# Altium schematic sheet VGA.SchDoc
size A4
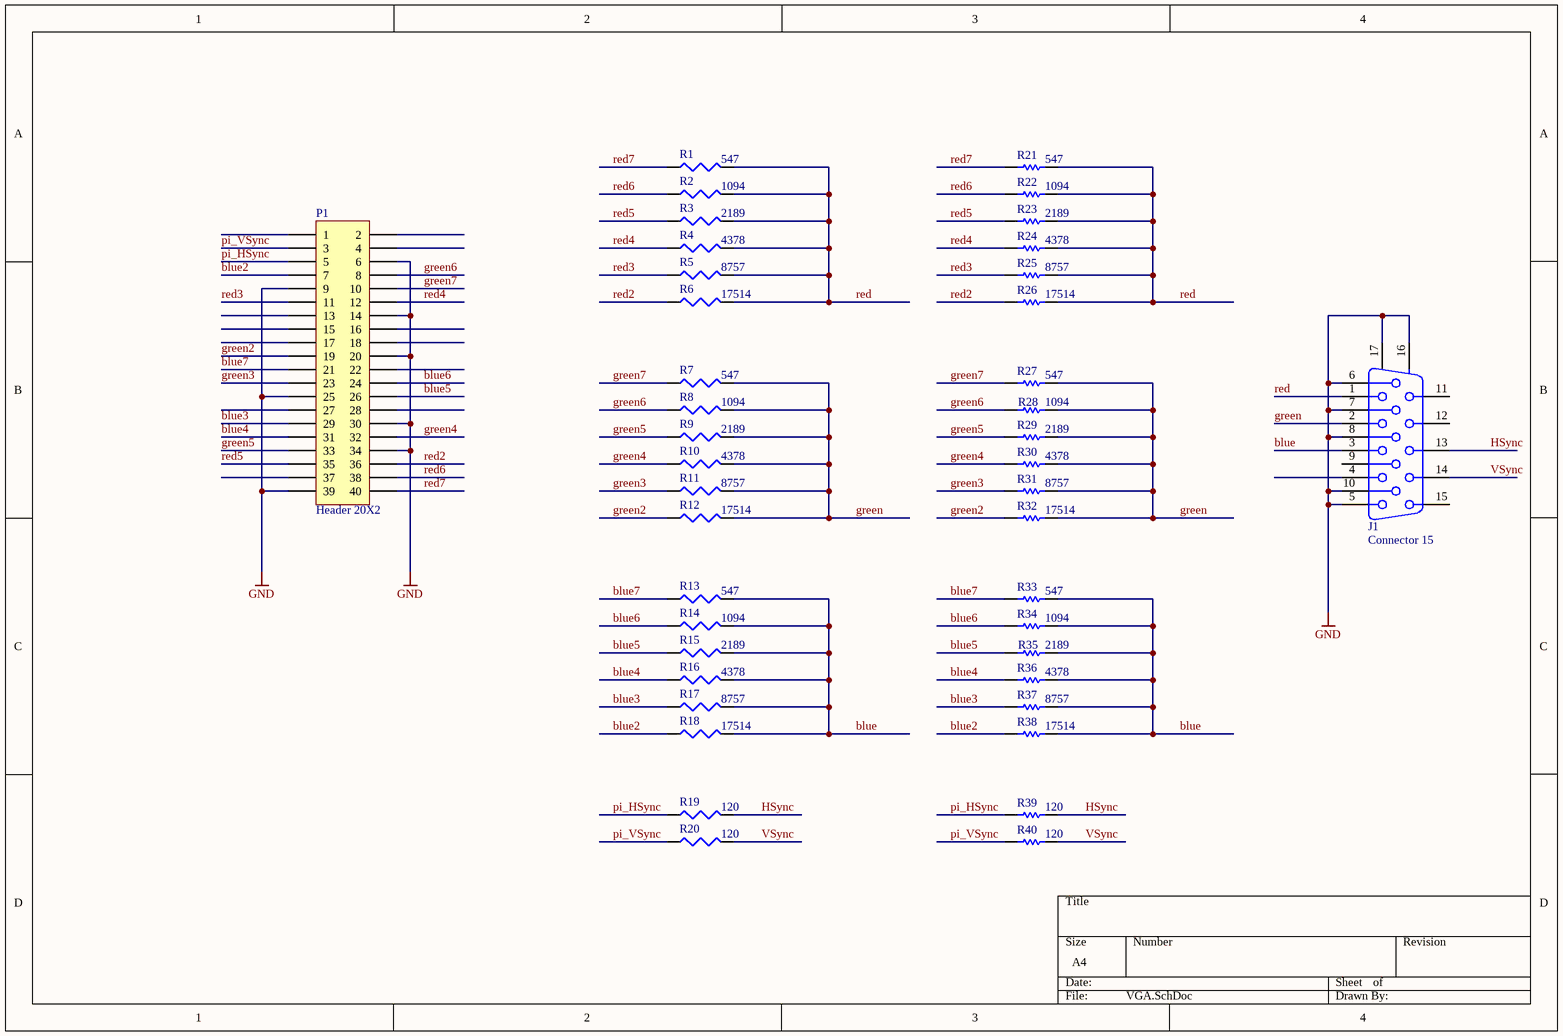
[diagram p0: VGA.SchDoc]

## Parts
J1  Connector 15  [MOLEX_048203-6043]
P1  Header 20X2  [HDR2X20]
R1  value 547  [J1-0603]  (hidden comment: Res3)
R2  value 1094  [J1-0603]  (hidden comment: Res3)
R3  value 2189  [J1-0603]  (hidden comment: Res3)
R4  value 4378  [J1-0603]  (hidden comment: Res3)
R5  value 8757  [J1-0603]  (hidden comment: Res3)
R6  value 17514  [J1-0603]  (hidden comment: Res3)
R7  value 547  [J1-0603]  (hidden comment: Res3)
R8  value 1094  [J1-0603]  (hidden comment: Res3)
R9  value 2189  [J1-0603]  (hidden comment: Res3)
R10  value 4378  [J1-0603]  (hidden comment: Res3)
R11  value 8757  [J1-0603]  (hidden comment: Res3)
R12  value 17514  [J1-0603]  (hidden comment: Res3)
R13  value 547  [J1-0603]  (hidden comment: Res3)
R14  value 1094  [J1-0603]  (hidden comment: Res3)
R15  value 2189  [J1-0603]  (hidden comment: Res3)
R16  value 4378  [J1-0603]  (hidden comment: Res3)
R17  value 8757  [J1-0603]  (hidden comment: Res3)
R18  value 17514  [J1-0603]  (hidden comment: Res3)
R19  value 120  [J1-0603]  (hidden comment: Res3)
R20  value 120  [J1-0603]  (hidden comment: Res3)
R21  value 547  [AXIAL-0.3]  (hidden comment: Res1)
R22  value 1094  [AXIAL-0.3]  (hidden comment: Res1)
R23  value 2189  [AXIAL-0.3]  (hidden comment: Res1)
R24  value 4378  [AXIAL-0.3]  (hidden comment: Res1)
R25  value 8757  [AXIAL-0.3]  (hidden comment: Res1)
R26  value 17514  [AXIAL-0.3]  (hidden comment: Res1)
R27  value 547  [AXIAL-0.3]  (hidden comment: Res1)
R28  value 1094  [AXIAL-0.3]  (hidden comment: Res1)
R29  value 2189  [AXIAL-0.3]  (hidden comment: Res1)
R30  value 4378  [AXIAL-0.3]  (hidden comment: Res1)
R31  value 8757  [AXIAL-0.3]  (hidden comment: Res1)
R32  value 17514  [AXIAL-0.3]  (hidden comment: Res1)
R33  value 547  [AXIAL-0.3]  (hidden comment: Res1)
R34  value 1094  [AXIAL-0.3]  (hidden comment: Res1)
R35  value 2189  [AXIAL-0.3]  (hidden comment: Res1)
R36  value 4378  [AXIAL-0.3]  (hidden comment: Res1)
R37  value 8757  [AXIAL-0.3]  (hidden comment: Res1)
R38  value 17514  [AXIAL-0.3]  (hidden comment: Res1)
R39  value 120  [AXIAL-0.3]  (hidden comment: Res1)
R40  value 120  [AXIAL-0.3]  (hidden comment: Res1)

## Nets
GND: J1.5 J1.6 J1.7 J1.8 J1.10 J1.16(MH1) J1.17(MH2) P1.6 P1.9 P1.14 P1.20 P1.25 P1.30 P1.34 P1.39
blue: J1.3 R13.2 R14.2 R15.2 R16.2 R17.2 R18.2 R33.2 R34.2 R35.2 R36.2 R37.2 R38.2
blue2: P1.7 R18.1 R38.1
blue3: P1.29 R17.1 R37.1
blue4: P1.31 R16.1 R36.1
blue5: P1.26 R15.1 R35.1
blue6: P1.24 R14.1 R34.1
blue7: P1.21 R13.1 R33.1
green: J1.2 R7.2 R8.2 R9.2 R10.2 R11.2 R12.2 R27.2 R28.2 R29.2 R30.2 R31.2 R32.2
green2: P1.19 R12.1 R32.1
green3: P1.23 R11.1 R31.1
green4: P1.32 R10.1 R30.1
green5: P1.33 R9.1 R29.1
green6: P1.8 R8.1 R28.1
green7: P1.10 R7.1 R27.1
HSync: J1.13 R19.2 R39.2
pi_HSync: P1.5 R19.1 R39.1
pi_VSync: P1.3 R20.1 R40.1
red: J1.1 R1.2 R2.2 R3.2 R4.2 R5.2 R6.2 R21.2 R22.2 R23.2 R24.2 R25.2 R26.2
red2: P1.36 R6.1 R26.1
red3: P1.11 R5.1 R25.1
red4: P1.12 R4.1 R24.1
red5: P1.35 R3.1 R23.1
red6: P1.38 R2.1 R22.1
red7: P1.40 R1.1 R21.1
VSync: J1.14 R20.2 R40.2

Not connected (* = marked no-connect by the designer): J1 4 9 11 12 15; P1 1 2 4 13 15 16 17 18 22 27 28 37

## Library data of the parts
J1 = Connector 15: Receptacle Assembly, 15-Pin, Sim Line Connector; PackageDocument: B; Positions: 15; Gender: Receptacle Header; Published: 15-Jun-2001; LatestRevisionDate: 17-Jul-2002; LatestRevisionNote: Re-released for DXP Platform.; DatasheetDocument: 24-Nov-1999; PackageReference: 788574; Publisher: Altium Limited; Orientation: Right Angle
P1 = Header 20X2: Header, 20-Pin, Dual row; LatestRevisionDate: 17-Jul-2002; LatestRevisionNote: Re-released for DXP Platform.; Publisher: Altium Limited
R1-R20 = Res3: Resistor; Published: 8-Jun-2000; LatestRevisionDate: 29-May-2009; LatestRevisionNote: IPC-7351 Footprint Added.; PackageReference: J1-0603; Publisher: Altium Limited; PackageDescription: Chip Resistor
R21-R40 = Res1: Resistor; Published: 8-Jun-2000; LatestRevisionDate: 17-Jul-2002; LatestRevisionNote: Re-released for DXP Platform.; PackageReference: AXIAL-0.3; Publisher: Altium Limited; PackageDescription: Axial Device, Thru-Hole; 2 Leads; 0.3 in Pin Spacing